# Altium project zesilovac.PrjPcb
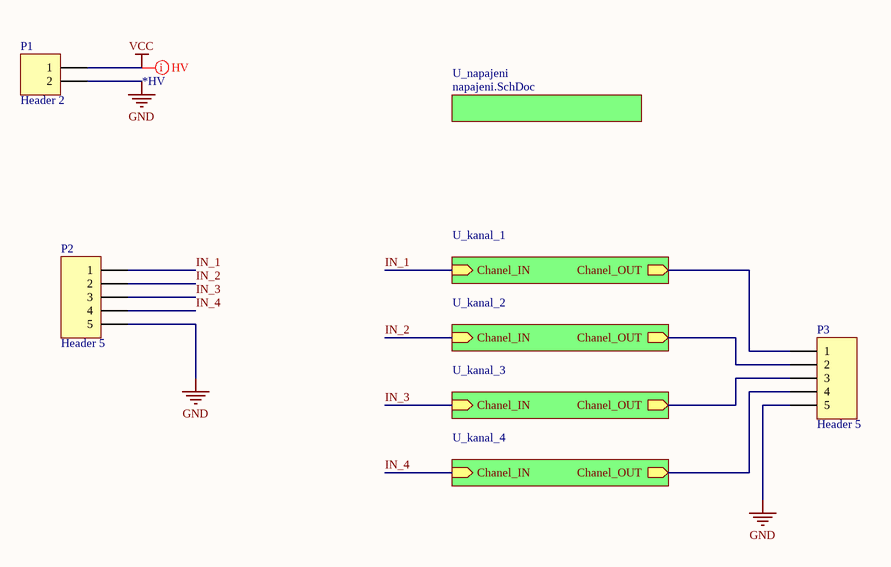
[diagram p0: main.SchDoc]
3 sheets, 18 parts. Net scope: hierarchical (ports join the sheet entries above them; power ports are global).
Board file: PCB_zesilovac.PcbDoc
Sheets:
  main.SchDoc
    U_kanal_1 = kanal.SchDoc
    U_kanal_2 = kanal.SchDoc
    U_kanal_3 = kanal.SchDoc
    U_kanal_4 = kanal.SchDoc
    U_napajeni = napajeni.SchDoc

## Sheet main.SchDoc
size A4

### Parts
P1  Header 2  [HDR1X2]
P2  Header 5  [HDR1X5]
P3  Header 5  [HDR1X5]

### Sub-sheets
U_kanal_1 = kanal.SchDoc: Chanel_IN (in), Chanel_OUT (out)
U_kanal_2 = kanal.SchDoc: Chanel_IN (in), Chanel_OUT (out)
U_kanal_3 = kanal.SchDoc: Chanel_IN (in), Chanel_OUT (out)
U_kanal_4 = kanal.SchDoc: Chanel_IN (in), Chanel_OUT (out)
U_napajeni = napajeni.SchDoc: no entries

### Nets
GND: P1.2 P2.5 P3.5
VCC: P1.1
IN_1: P2.1 ; sheet U_kanal_1/Chanel_IN
IN_2: P2.2 ; sheet U_kanal_2/Chanel_IN
IN_3: P2.3 ; sheet U_kanal_3/Chanel_IN
IN_4: P2.4 ; sheet U_kanal_4/Chanel_IN
NetP3_1: P3.1 ; sheet U_kanal_1/Chanel_OUT
NetP3_2: P3.2 ; sheet U_kanal_2/Chanel_OUT
NetP3_3: P3.3 ; sheet U_kanal_3/Chanel_OUT
NetP3_4: P3.4 ; sheet U_kanal_4/Chanel_OUT

### Layout directives
net class *HV: VCC

### Library data of the parts
P1 = Header 2: Header, 2-Pin; LatestRevisionDate: 17-Jul-2002; LatestRevisionNote: Re-released for DXP Platform.; Publisher: Altium Limited
P2 P3 = Header 5: Header, 5-Pin; LatestRevisionDate: 17-Jul-2002; LatestRevisionNote: Re-released for DXP Platform.; Publisher: Altium Limited

## Sheet kanal.SchDoc
size A4
Used 4 times, as channels U_kanal_1, U_kanal_2, U_kanal_3, U_kanal_4. Parts and nets are listed once, with the designators drawn on the sheet.
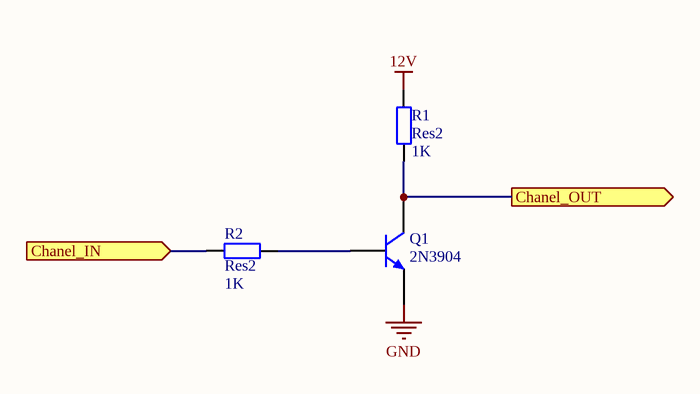
[diagram p1: kanal.SchDoc]

### Parts
Q1  2N3904  [TO-92A]
R1  Res2  value 1K  [AXIAL-0.4]
R2  Res2  value 1K  [AXIAL-0.4]

### Ports
Chanel_IN (in), Chanel_OUT (out)

### Nets
12V: R1.2
GND: Q1.1(E)
Chanel_IN: R2.1 ; port Chanel_IN
Chanel_OUT: Q1.3(C) R1.1 ; port Chanel_OUT
NetQ1_2: Q1.2(B) R2.2

### Channels
U_kanal_1: designators end in A; ports Chanel_IN=IN_1 Chanel_OUT=NetP3_1
U_kanal_2: designators end in B; ports Chanel_IN=IN_2 Chanel_OUT=NetP3_2
U_kanal_3: designators end in C; ports Chanel_IN=IN_3 Chanel_OUT=NetP3_3
U_kanal_4: designators end in D; ports Chanel_IN=IN_4 Chanel_OUT=NetP3_4

### Library data of the parts
Q1 = 2N3904: NPN General Purpose Amplifier; Published: 8-Jun-2000; LatestRevisionDate: 15-Jan-2003; LatestRevisionNote: PCB Footprint 'BCY-W3/D4.7' replaced; DatasheetVersion: 1997; PackageVersion: Sep-1998; PackageReference: TO-92A; Publisher: Altium Limited; PackageDescription: TO, Flat Index; 3 In-Line, Axial Leads; Body Dia. 4.5mm; Leads 0.51 x 0.48 mm (max); ComponentLink1Description: Manufacturer Link; ComponentLink1URL: http://www.fairchildsemi.com/; ComponentLink2Description: Datasheet; ComponentLink2URL: http://www.fairchildsemi.com/ds/2N%2F2N3904.pdf
R1 R2 = Res2: Resistor; Published: 8-Jun-2000; LatestRevisionDate: 17-Jul-2002; LatestRevisionNote: Re-released for DXP Platform.; PackageReference: AXIAL-0.4; Publisher: Altium Limited; PackageDescription: Axial Device, Thru-Hole; 2 Leads; 0.4 in Pin Spacing

## Sheet napajeni.SchDoc
size A4
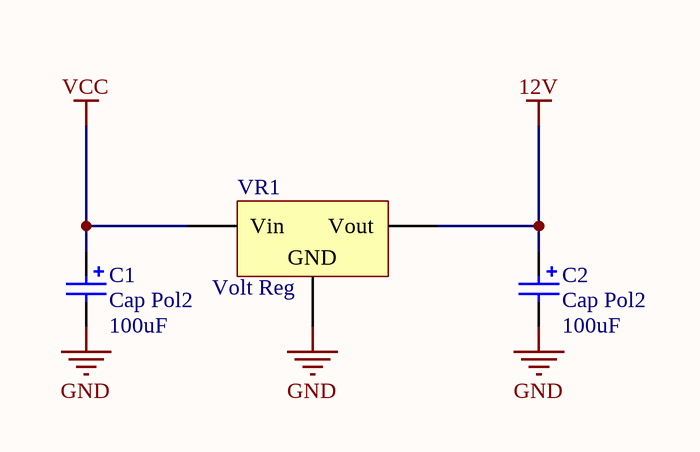
[diagram p2: napajeni.SchDoc]

### Parts
C1  Cap Pol2  value 100uF  [POLAR0.8]
C2  Cap Pol2  value 100uF  [POLAR0.8]
VR1  Volt Reg  [D2PAK_N]

### Nets
12V: C2.1 VR1.3(Vout)
GND: C1.2 C2.2 VR1.2(GND)
VCC: C1.1 VR1.1(Vin)

### Library data of the parts
C1 C2 = Cap Pol2: Polarized Capacitor (Axial); Published: 8-Jun-2000; LatestRevisionDate: 17-Jul-2002; LatestRevisionNote: Re-released for DXP Platform.; PackageReference: POLAR0.8; Publisher: Altium Limited; PackageDescription: Polarized Capacitor; 2 Leads
VR1 = Volt Reg: Voltage Regulator; Published: 24-Mar-1999; LatestRevisionDate: 29-May-2009; LatestRevisionNote: IPC-7351 Footprint Added.; PackageReference: D2PAK; Publisher: Altium Limited; PackageDescription: 3-Pin Transistor Outline Package 2.54 mm Pitch, 15.1 mm Lead Span

## Nets that join several sheets
12V: U_kanal_1 (R1A.2), U_kanal_2 (R1B.2), U_kanal_3 (R1C.2), U_kanal_4 (R1D.2), napajeni (C2.1 VR1.3)
GND: main (P1.2 P2.5 P3.5), U_kanal_1 (Q1A.1), U_kanal_2 (Q1B.1), U_kanal_3 (Q1C.1), U_kanal_4 (Q1D.1), napajeni (C1.2 C2.2 VR1.2)
VCC: main (P1.1), napajeni (C1.1 VR1.1)
IN_1: main (P2.1), U_kanal_1 (R2A.1)
IN_2: main (P2.2), U_kanal_2 (R2B.1)
IN_3: main (P2.3), U_kanal_3 (R2C.1)
IN_4: main (P2.4), U_kanal_4 (R2D.1)
NetP3_1: main (P3.1), U_kanal_1 (Q1A.3 R1A.1)
NetP3_2: main (P3.2), U_kanal_2 (Q1B.3 R1B.1)
NetP3_3: main (P3.3), U_kanal_3 (Q1C.3 R1C.1)
NetP3_4: main (P3.4), U_kanal_4 (Q1D.3 R1D.1)